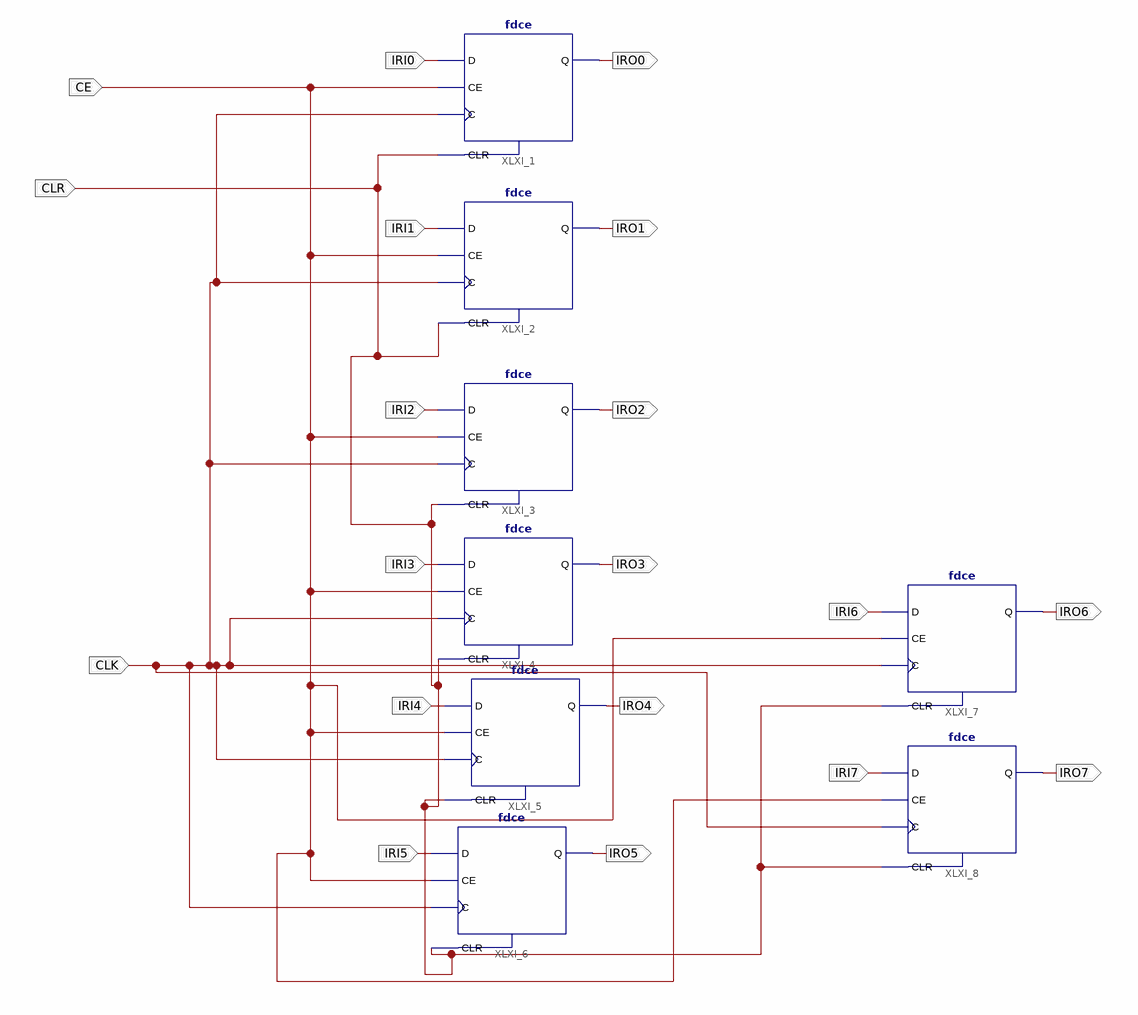
[diagram p0: schematic sheet 1]
// Xilinx ISE schematic InstructionRegister.sch (spartan3e) as structural Verilog: 8 symbols, 19 ports
module InstructionRegister (
  input  IRI0,
  input  IRI1,
  input  IRI2,
  input  IRI3,
  input  IRI4,
  input  IRI5,
  input  IRI6,
  input  IRI7,
  input  CE,
  input  CLK,
  input  CLR,
  output IRO0,
  output IRO1,
  output IRO2,
  output IRO3,
  output IRO4,
  output IRO5,
  output IRO6,
  output IRO7
);

  fdce XLXI_1 (.C(CLK), .CE(CE), .CLR(CLR), .D(IRI0), .Q(IRO0));
  fdce XLXI_2 (.C(CLK), .CE(CE), .CLR(CLR), .D(IRI1), .Q(IRO1));
  fdce XLXI_3 (.C(CLK), .CE(CE), .CLR(CLR), .D(IRI2), .Q(IRO2));
  fdce XLXI_4 (.C(CLK), .CE(CE), .CLR(CLR), .D(IRI3), .Q(IRO3));
  fdce XLXI_5 (.C(CLK), .CE(CE), .CLR(CLR), .D(IRI4), .Q(IRO4));
  fdce XLXI_6 (.C(CLK), .CE(CE), .CLR(CLR), .D(IRI5), .Q(IRO5));
  fdce XLXI_7 (.C(CLK), .CE(CE), .CLR(CLR), .D(IRI6), .Q(IRO6));
  fdce XLXI_8 (.C(CLK), .CE(CE), .CLR(CLR), .D(IRI7), .Q(IRO7));
endmodule
